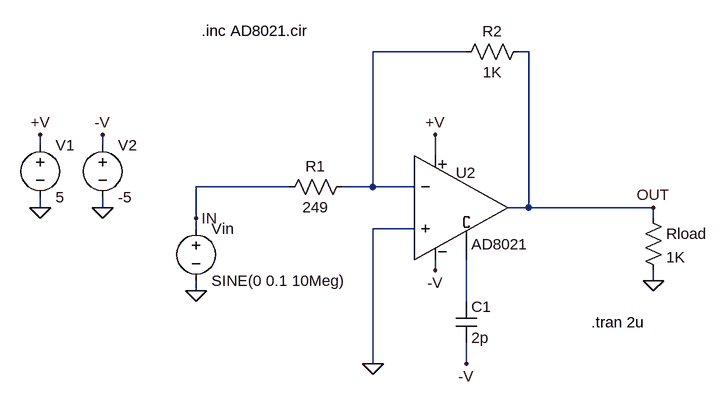
[diagram p0: schematic AD8021Simulation.asc]
AD8021Simulation.asc, the LTspice schematic file:
Version 4
SHEET 1 1240 700
WIRE 544 -1344 400 -1344
WIRE 640 -1344 624 -1344
WIRE -112 -1200 -112 -1216
WIRE -16 -1200 -16 -1216
WIRE 496 -1184 496 -1216
WIRE 272 -1136 128 -1136
WIRE 400 -1136 400 -1344
WIRE 400 -1136 352 -1136
WIRE 464 -1136 400 -1136
WIRE -112 -1104 -112 -1120
WIRE -16 -1104 -16 -1120
WIRE 640 -1104 640 -1344
WIRE 640 -1104 608 -1104
WIRE 832 -1104 640 -1104
WIRE 128 -1088 128 -1136
WIRE 832 -1088 832 -1104
WIRE 128 -1072 128 -1088
WIRE 464 -1072 400 -1072
WIRE 496 -1008 496 -1024
WIRE 832 -992 832 -1008
WIRE 128 -976 128 -992
WIRE 544 -960 544 -1024
WIRE 400 -864 400 -1072
WIRE 544 -864 544 -896
FLAG -112 -1216 +V
FLAG 128 -976 0
FLAG 832 -1104 OUT
FLAG 128 -1088 IN
FLAG 496 -1216 +V
FLAG -16 -1216 -V
FLAG 496 -1008 -V
FLAG 832 -992 0
FLAG -16 -1104 0
FLAG -112 -1104 0
FLAG 544 -864 -V
FLAG 400 -864 0
SYMBOL voltage -112 -1216 R0
WINDOW 123 0 0 Left 2
WINDOW 39 0 0 Left 2
SYMATTR InstName V1
SYMATTR Value 5
SYMBOL voltage 128 -1088 R0
WINDOW 123 24 146 Left 2
WINDOW 39 24 125 Left 2
SYMATTR InstName Vin
SYMATTR Value SINE(0 0.1 10Meg)
SYMBOL res 368 -1152 R90
WINDOW 0 0 56 VBottom 2
WINDOW 3 32 56 VTop 2
SYMATTR InstName R1
SYMATTR Value 249
SYMBOL res 640 -1360 R90
WINDOW 0 0 56 VBottom 2
WINDOW 3 32 56 VTop 2
SYMATTR InstName R2
SYMATTR Value 1K
SYMBOL voltage -16 -1216 R0
WINDOW 123 24 146 Left 2
WINDOW 39 24 125 Left 2
SYMATTR InstName V2
SYMATTR Value -5
SYMBOL res 816 -1104 R0
SYMATTR InstName Rload
SYMATTR Value 1K
SYMBOL AD8021Wrapper 496 -1104 R0
SYMATTR InstName U2
SYMBOL cap 528 -960 R0
SYMATTR InstName C1
SYMATTR Value 2p
TEXT 736 -928 Left 2 !.tran 2u
TEXT 136 -1376 Left 2 !.inc AD8021.cir

The netlist it stands for:
* AD8021Simulation.asc
V1 +V 0 5
Vin IN 0 SINE(0 0.1 10Meg)
R1 N001 IN 249
R2 OUT N001 1K
V2 -V 0 -5
Rload OUT 0 1K
XU2 0 N001 +V -V OUT N002 AD8021  ; pins In+ In- V+ V- OUT CMP
C1 N002 -V 2p
.tran 2u
.inc AD8021.cir
.lib LTC.lib
.backanno
.end